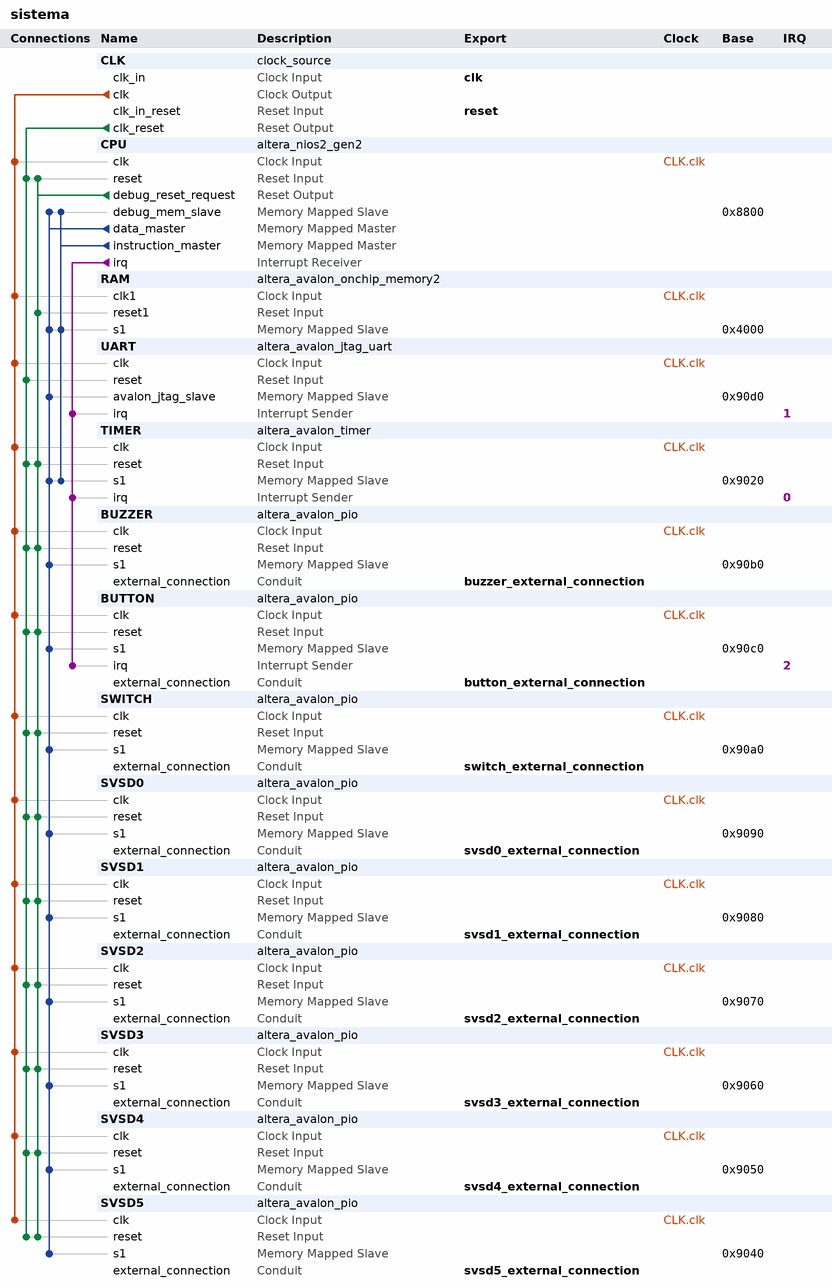
[diagram p0: system contents]
# Platform Designer (Qsys) system sistema, Cyclone IV E EP4CE10E22A7
# Parameters at their usual value, and those the tool derives, are not listed.
package require -exact qsys 18.1
create_system sistema
set_project_property DEVICE_FAMILY {Cyclone IV E}
set_project_property DEVICE EP4CE10E22A7

add_instance CLK clock_source 18.1
set_instance_parameter_value CLK clockFrequency 50000000

add_instance CPU altera_nios2_gen2 18.1
set_instance_parameter_value CPU dcache_size 2048
set_instance_parameter_value CPU exceptionSlave RAM.s1
set_instance_parameter_value CPU icache_size 4096
set_instance_parameter_value CPU impl Tiny
set_instance_parameter_value CPU resetSlave RAM.s1

add_instance RAM altera_avalon_onchip_memory2 18.1
set_instance_parameter_value RAM dataWidth 32
set_instance_parameter_value RAM dualPort false
set_instance_parameter_value RAM initMemContent true
set_instance_parameter_value RAM initializationFileName onchip_mem.hex
set_instance_parameter_value RAM memorySize 15000

add_instance UART altera_avalon_jtag_uart 18.1
set_instance_parameter_value UART simInteractiveOptions NO_INTERACTIVE_WINDOWS

add_instance TIMER altera_avalon_timer 18.1
set_instance_parameter_value TIMER fixedPeriod true
set_instance_parameter_value TIMER period 1
set_instance_parameter_value TIMER periodUnits MSEC

add_instance BUZZER altera_avalon_pio 18.1
set_instance_parameter_value BUZZER direction Output
set_instance_parameter_value BUZZER width 10

add_instance BUTTON altera_avalon_pio 18.1
set_instance_parameter_value BUTTON captureEdge true
set_instance_parameter_value BUTTON direction Input
set_instance_parameter_value BUTTON generateIRQ true
set_instance_parameter_value BUTTON irqType EDGE
set_instance_parameter_value BUTTON simDoTestBenchWiring true
set_instance_parameter_value BUTTON width 4

add_instance SWITCH altera_avalon_pio 18.1
set_instance_parameter_value SWITCH direction Output
set_instance_parameter_value SWITCH width 8

add_instance SVSD0 altera_avalon_pio 18.1
set_instance_parameter_value SVSD0 direction Output
set_instance_parameter_value SVSD0 width 4

add_instance SVSD1 altera_avalon_pio 18.1
set_instance_parameter_value SVSD1 direction Output
set_instance_parameter_value SVSD1 width 4

add_instance SVSD2 altera_avalon_pio 18.1
set_instance_parameter_value SVSD2 direction Output
set_instance_parameter_value SVSD2 width 4

add_instance SVSD3 altera_avalon_pio 18.1
set_instance_parameter_value SVSD3 direction Output
set_instance_parameter_value SVSD3 width 4

add_instance SVSD4 altera_avalon_pio 18.1
set_instance_parameter_value SVSD4 direction Output
set_instance_parameter_value SVSD4 width 4

add_instance SVSD5 altera_avalon_pio 18.1
set_instance_parameter_value SVSD5 direction Output
set_instance_parameter_value SVSD5 width 4

# connections
add_connection CLK.clk BUTTON.clk clock
add_connection CLK.clk BUZZER.clk clock
add_connection CLK.clk CPU.clk clock
add_connection CLK.clk RAM.clk1 clock
add_connection CLK.clk SVSD0.clk clock
add_connection CLK.clk SVSD1.clk clock
add_connection CLK.clk SVSD2.clk clock
add_connection CLK.clk SVSD3.clk clock
add_connection CLK.clk SVSD4.clk clock
add_connection CLK.clk SVSD5.clk clock
add_connection CLK.clk SWITCH.clk clock
add_connection CLK.clk TIMER.clk clock
add_connection CLK.clk UART.clk clock
add_connection CLK.clk_reset BUTTON.reset reset
add_connection CLK.clk_reset BUZZER.reset reset
add_connection CLK.clk_reset CPU.reset reset
add_connection CLK.clk_reset SVSD0.reset reset
add_connection CLK.clk_reset SVSD1.reset reset
add_connection CLK.clk_reset SVSD2.reset reset
add_connection CLK.clk_reset SVSD3.reset reset
add_connection CLK.clk_reset SVSD4.reset reset
add_connection CLK.clk_reset SVSD5.reset reset
add_connection CLK.clk_reset SWITCH.reset reset
add_connection CLK.clk_reset TIMER.reset reset
add_connection CLK.clk_reset UART.reset reset
add_connection CPU.debug_reset_request BUTTON.reset reset
add_connection CPU.debug_reset_request BUZZER.reset reset
add_connection CPU.debug_reset_request CPU.reset reset
add_connection CPU.debug_reset_request RAM.reset1 reset
add_connection CPU.debug_reset_request SVSD0.reset reset
add_connection CPU.debug_reset_request SVSD1.reset reset
add_connection CPU.debug_reset_request SVSD2.reset reset
add_connection CPU.debug_reset_request SVSD3.reset reset
add_connection CPU.debug_reset_request SVSD4.reset reset
add_connection CPU.debug_reset_request SVSD5.reset reset
add_connection CPU.debug_reset_request SWITCH.reset reset
add_connection CPU.debug_reset_request TIMER.reset reset
add_connection CPU.data_master BUTTON.s1 avalon
set_connection_parameter_value CPU.data_master/BUTTON.s1 baseAddress 0x90c0
add_connection CPU.data_master BUZZER.s1 avalon
set_connection_parameter_value CPU.data_master/BUZZER.s1 baseAddress 0x90b0
add_connection CPU.data_master CPU.debug_mem_slave avalon
set_connection_parameter_value CPU.data_master/CPU.debug_mem_slave baseAddress 0x8800
add_connection CPU.data_master RAM.s1 avalon
set_connection_parameter_value CPU.data_master/RAM.s1 baseAddress 0x4000
add_connection CPU.data_master SVSD0.s1 avalon
set_connection_parameter_value CPU.data_master/SVSD0.s1 baseAddress 0x9090
add_connection CPU.data_master SVSD1.s1 avalon
set_connection_parameter_value CPU.data_master/SVSD1.s1 baseAddress 0x9080
add_connection CPU.data_master SVSD2.s1 avalon
set_connection_parameter_value CPU.data_master/SVSD2.s1 baseAddress 0x9070
add_connection CPU.data_master SVSD3.s1 avalon
set_connection_parameter_value CPU.data_master/SVSD3.s1 baseAddress 0x9060
add_connection CPU.data_master SVSD4.s1 avalon
set_connection_parameter_value CPU.data_master/SVSD4.s1 baseAddress 0x9050
add_connection CPU.data_master SVSD5.s1 avalon
set_connection_parameter_value CPU.data_master/SVSD5.s1 baseAddress 0x9040
add_connection CPU.data_master SWITCH.s1 avalon
set_connection_parameter_value CPU.data_master/SWITCH.s1 baseAddress 0x90a0
add_connection CPU.data_master TIMER.s1 avalon
set_connection_parameter_value CPU.data_master/TIMER.s1 baseAddress 0x9020
add_connection CPU.data_master UART.avalon_jtag_slave avalon
set_connection_parameter_value CPU.data_master/UART.avalon_jtag_slave baseAddress 0x90d0
add_connection CPU.instruction_master CPU.debug_mem_slave avalon
set_connection_parameter_value CPU.instruction_master/CPU.debug_mem_slave baseAddress 0x8800
add_connection CPU.instruction_master RAM.s1 avalon
set_connection_parameter_value CPU.instruction_master/RAM.s1 baseAddress 0x4000
add_connection CPU.instruction_master TIMER.s1 avalon
set_connection_parameter_value CPU.instruction_master/TIMER.s1 baseAddress 0x9020
add_connection CPU.irq BUTTON.irq interrupt
set_connection_parameter_value CPU.irq/BUTTON.irq irqNumber 2
add_connection CPU.irq TIMER.irq interrupt
set_connection_parameter_value CPU.irq/TIMER.irq irqNumber 0
add_connection CPU.irq UART.irq interrupt
set_connection_parameter_value CPU.irq/UART.irq irqNumber 1

# exported interfaces
add_interface button_external_connection conduit end
set_interface_property button_external_connection EXPORT_OF BUTTON.external_connection
add_interface buzzer_external_connection conduit end
set_interface_property buzzer_external_connection EXPORT_OF BUZZER.external_connection
add_interface clk clock sink
set_interface_property clk EXPORT_OF CLK.clk_in
add_interface reset reset sink
set_interface_property reset EXPORT_OF CLK.clk_in_reset
add_interface svsd0_external_connection conduit end
set_interface_property svsd0_external_connection EXPORT_OF SVSD0.external_connection
add_interface svsd1_external_connection conduit end
set_interface_property svsd1_external_connection EXPORT_OF SVSD1.external_connection
add_interface svsd2_external_connection conduit end
set_interface_property svsd2_external_connection EXPORT_OF SVSD2.external_connection
add_interface svsd3_external_connection conduit end
set_interface_property svsd3_external_connection EXPORT_OF SVSD3.external_connection
add_interface svsd4_external_connection conduit end
set_interface_property svsd4_external_connection EXPORT_OF SVSD4.external_connection
add_interface svsd5_external_connection conduit end
set_interface_property svsd5_external_connection EXPORT_OF SVSD5.external_connection
add_interface switch_external_connection conduit end
set_interface_property switch_external_connection EXPORT_OF SWITCH.external_connection

set_interconnect_requirement {$system} qsys_mm.clockCrossingAdapter HANDSHAKE
set_interconnect_requirement {$system} qsys_mm.enableEccProtection FALSE
set_interconnect_requirement {$system} qsys_mm.insertDefaultSlave FALSE
set_interconnect_requirement {$system} qsys_mm.maxAdditionalLatency 1

save_system sistema.qsys
